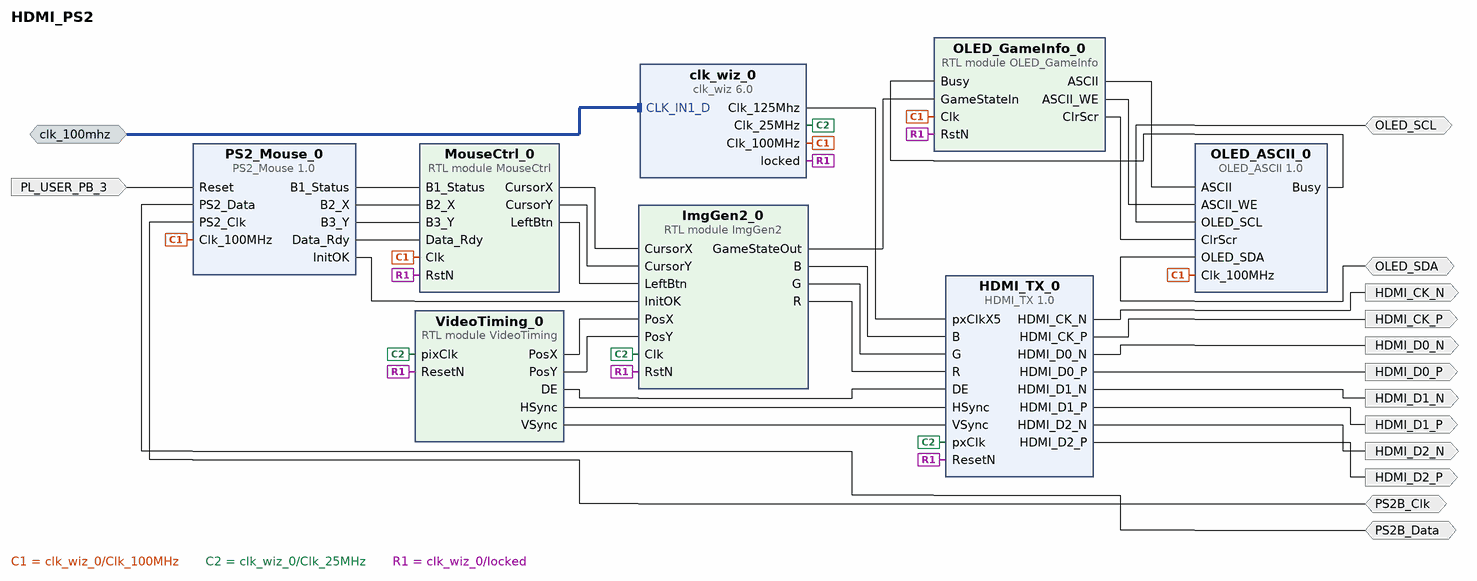
[diagram p0: block diagram of the top level]
# Vivado block design HDMI_PS2, xczu3eg-sfvc784-2-e, Vivado 2025.1
create_bd_design HDMI_PS2

create_bd_intf_port -mode Slave -vlnv xilinx.com:interface:diff_clock_rtl:1.0 clk_100mhz
create_bd_port -dir O HDMI_D0_P
create_bd_port -dir O HDMI_D0_N
create_bd_port -dir O HDMI_D1_P
create_bd_port -dir O HDMI_D1_N
create_bd_port -dir O HDMI_D2_P
create_bd_port -dir O HDMI_D2_N
create_bd_port -dir O HDMI_CK_P
create_bd_port -dir O HDMI_CK_N
create_bd_port -dir IO PS2B_Data
create_bd_port -dir IO PS2B_Clk
create_bd_port -dir IO OLED_SDA
create_bd_port -dir IO OLED_SCL
create_bd_port -dir I PL_USER_PB_3

create_bd_cell -type ip -vlnv JS_WUST:UCiSW:HDMI_TX:1.0 HDMI_TX_0
create_bd_cell -type module -reference VideoTiming VideoTiming_0
create_bd_cell -type ip -vlnv xilinx.com:ip:clk_wiz:6.0 clk_wiz_0
set_property -dict [list \
  CONFIG.CLKOUT1_JITTER 175.402 \
  CONFIG.CLKOUT1_PHASE_ERROR 98.575 \
  CONFIG.CLKOUT1_REQUESTED_OUT_FREQ 25.000 \
  CONFIG.CLKOUT2_JITTER 125.247 \
  CONFIG.CLKOUT2_PHASE_ERROR 98.575 \
  CONFIG.CLKOUT2_REQUESTED_OUT_FREQ 125.000 \
  CONFIG.CLKOUT2_USED true \
  CONFIG.CLKOUT3_JITTER 130.958 \
  CONFIG.CLKOUT3_PHASE_ERROR 98.575 \
  CONFIG.CLKOUT3_USED true \
  CONFIG.CLK_IN1_BOARD_INTERFACE clk_100mhz \
  CONFIG.CLK_OUT1_PORT Clk_25MHz \
  CONFIG.CLK_OUT2_PORT Clk_125Mhz \
  CONFIG.CLK_OUT3_PORT Clk_100MHz \
  CONFIG.MMCM_CLKFBOUT_MULT_F 10.000 \
  CONFIG.MMCM_CLKOUT0_DIVIDE_F 40.000 \
  CONFIG.MMCM_CLKOUT1_DIVIDE 8 \
  CONFIG.MMCM_CLKOUT2_DIVIDE 10 \
  CONFIG.NUM_OUT_CLKS 3 \
  CONFIG.PRIM_SOURCE Differential_clock_capable_pin \
  CONFIG.USE_RESET false \
] [get_bd_cells clk_wiz_0]
create_bd_cell -type ip -vlnv JS_WUST:UCiSW:PS2_Mouse:1.0 PS2_Mouse_0
create_bd_cell -type ip -vlnv JS_WUST:UCiSW:OLED_ASCII:1.0 OLED_ASCII_0
create_bd_cell -type module -reference MouseCtrl MouseCtrl_0
create_bd_cell -type module -reference OLED_GameInfo OLED_GameInfo_0
create_bd_cell -type module -reference ImgGen2 ImgGen2_0

# ---- connections ----

connect_bd_intf_net -intf_net CLK_IN1_D_0_1 [get_bd_intf_ports clk_100mhz] [get_bd_intf_pins clk_wiz_0/CLK_IN1_D]
connect_bd_net [get_bd_pins HDMI_TX_0/HDMI_CK_N] [get_bd_ports HDMI_CK_N]
connect_bd_net [get_bd_pins HDMI_TX_0/HDMI_CK_P] [get_bd_ports HDMI_CK_P]
connect_bd_net [get_bd_pins HDMI_TX_0/HDMI_D0_N] [get_bd_ports HDMI_D0_N]
connect_bd_net [get_bd_pins HDMI_TX_0/HDMI_D0_P] [get_bd_ports HDMI_D0_P]
connect_bd_net [get_bd_pins HDMI_TX_0/HDMI_D1_N] [get_bd_ports HDMI_D1_N]
connect_bd_net [get_bd_pins HDMI_TX_0/HDMI_D1_P] [get_bd_ports HDMI_D1_P]
connect_bd_net [get_bd_pins HDMI_TX_0/HDMI_D2_N] [get_bd_ports HDMI_D2_N]
connect_bd_net [get_bd_pins HDMI_TX_0/HDMI_D2_P] [get_bd_ports HDMI_D2_P]
connect_bd_net [get_bd_pins ImgGen2_0/B] [get_bd_pins HDMI_TX_0/B]
connect_bd_net [get_bd_pins ImgGen2_0/G] [get_bd_pins HDMI_TX_0/G]
connect_bd_net [get_bd_pins ImgGen2_0/GameStateOut] [get_bd_pins OLED_GameInfo_0/GameStateIn]
connect_bd_net [get_bd_pins ImgGen2_0/R] [get_bd_pins HDMI_TX_0/R]
connect_bd_net [get_bd_pins MouseCtrl_0/CursorX] [get_bd_pins ImgGen2_0/CursorX]
connect_bd_net [get_bd_pins MouseCtrl_0/CursorY] [get_bd_pins ImgGen2_0/CursorY]
connect_bd_net [get_bd_pins MouseCtrl_0/LeftBtn] [get_bd_pins ImgGen2_0/LeftBtn]
connect_bd_net [get_bd_ports PS2B_Data] [get_bd_pins PS2_Mouse_0/PS2_Data]
connect_bd_net [get_bd_ports PS2B_Clk] [get_bd_pins PS2_Mouse_0/PS2_Clk]
connect_bd_net [get_bd_ports OLED_SDA] [get_bd_pins OLED_ASCII_0/OLED_SDA]
connect_bd_net [get_bd_ports OLED_SCL] [get_bd_pins OLED_ASCII_0/OLED_SCL]
connect_bd_net [get_bd_pins OLED_ASCII_0/Busy] [get_bd_pins OLED_GameInfo_0/Busy]
connect_bd_net [get_bd_pins OLED_GameInfo_0/ASCII] [get_bd_pins OLED_ASCII_0/ASCII]
connect_bd_net [get_bd_pins OLED_GameInfo_0/ASCII_WE] [get_bd_pins OLED_ASCII_0/ASCII_WE]
connect_bd_net [get_bd_pins OLED_GameInfo_0/ClrScr] [get_bd_pins OLED_ASCII_0/ClrScr]
connect_bd_net [get_bd_pins PS2_Mouse_0/B1_Status] [get_bd_pins MouseCtrl_0/B1_Status]
connect_bd_net [get_bd_pins PS2_Mouse_0/B2_X] [get_bd_pins MouseCtrl_0/B2_X]
connect_bd_net [get_bd_pins PS2_Mouse_0/B3_Y] [get_bd_pins MouseCtrl_0/B3_Y]
connect_bd_net [get_bd_pins PS2_Mouse_0/Data_Rdy] [get_bd_pins MouseCtrl_0/Data_Rdy]
connect_bd_net [get_bd_pins PS2_Mouse_0/InitOK] [get_bd_pins ImgGen2_0/InitOK]
connect_bd_net -net Reset_0_1 [get_bd_ports PL_USER_PB_3] [get_bd_pins PS2_Mouse_0/Reset]
connect_bd_net [get_bd_pins VideoTiming_0/DE] [get_bd_pins HDMI_TX_0/DE]
connect_bd_net [get_bd_pins VideoTiming_0/HSync] [get_bd_pins HDMI_TX_0/HSync]
connect_bd_net [get_bd_pins VideoTiming_0/PosX] [get_bd_pins ImgGen2_0/PosX]
connect_bd_net [get_bd_pins VideoTiming_0/PosY] [get_bd_pins ImgGen2_0/PosY]
connect_bd_net [get_bd_pins VideoTiming_0/VSync] [get_bd_pins HDMI_TX_0/VSync]
connect_bd_net [get_bd_pins clk_wiz_0/Clk_100MHz] \
  [get_bd_pins PS2_Mouse_0/Clk_100MHz] [get_bd_pins MouseCtrl_0/Clk] [get_bd_pins OLED_ASCII_0/Clk_100MHz] \
  [get_bd_pins OLED_GameInfo_0/Clk]
connect_bd_net [get_bd_pins clk_wiz_0/Clk_125Mhz] [get_bd_pins HDMI_TX_0/pxClkX5]
connect_bd_net [get_bd_pins clk_wiz_0/Clk_25MHz] [get_bd_pins VideoTiming_0/pixClk] [get_bd_pins HDMI_TX_0/pxClk] [get_bd_pins ImgGen2_0/Clk]
connect_bd_net [get_bd_pins clk_wiz_0/locked] \
  [get_bd_pins MouseCtrl_0/RstN] [get_bd_pins VideoTiming_0/ResetN] [get_bd_pins HDMI_TX_0/ResetN] \
  [get_bd_pins ImgGen2_0/RstN] [get_bd_pins OLED_GameInfo_0/RstN]

validate_bd_design
save_bd_design
